# EAGLE design Variable and Constant (EAGLE 9.6.2)
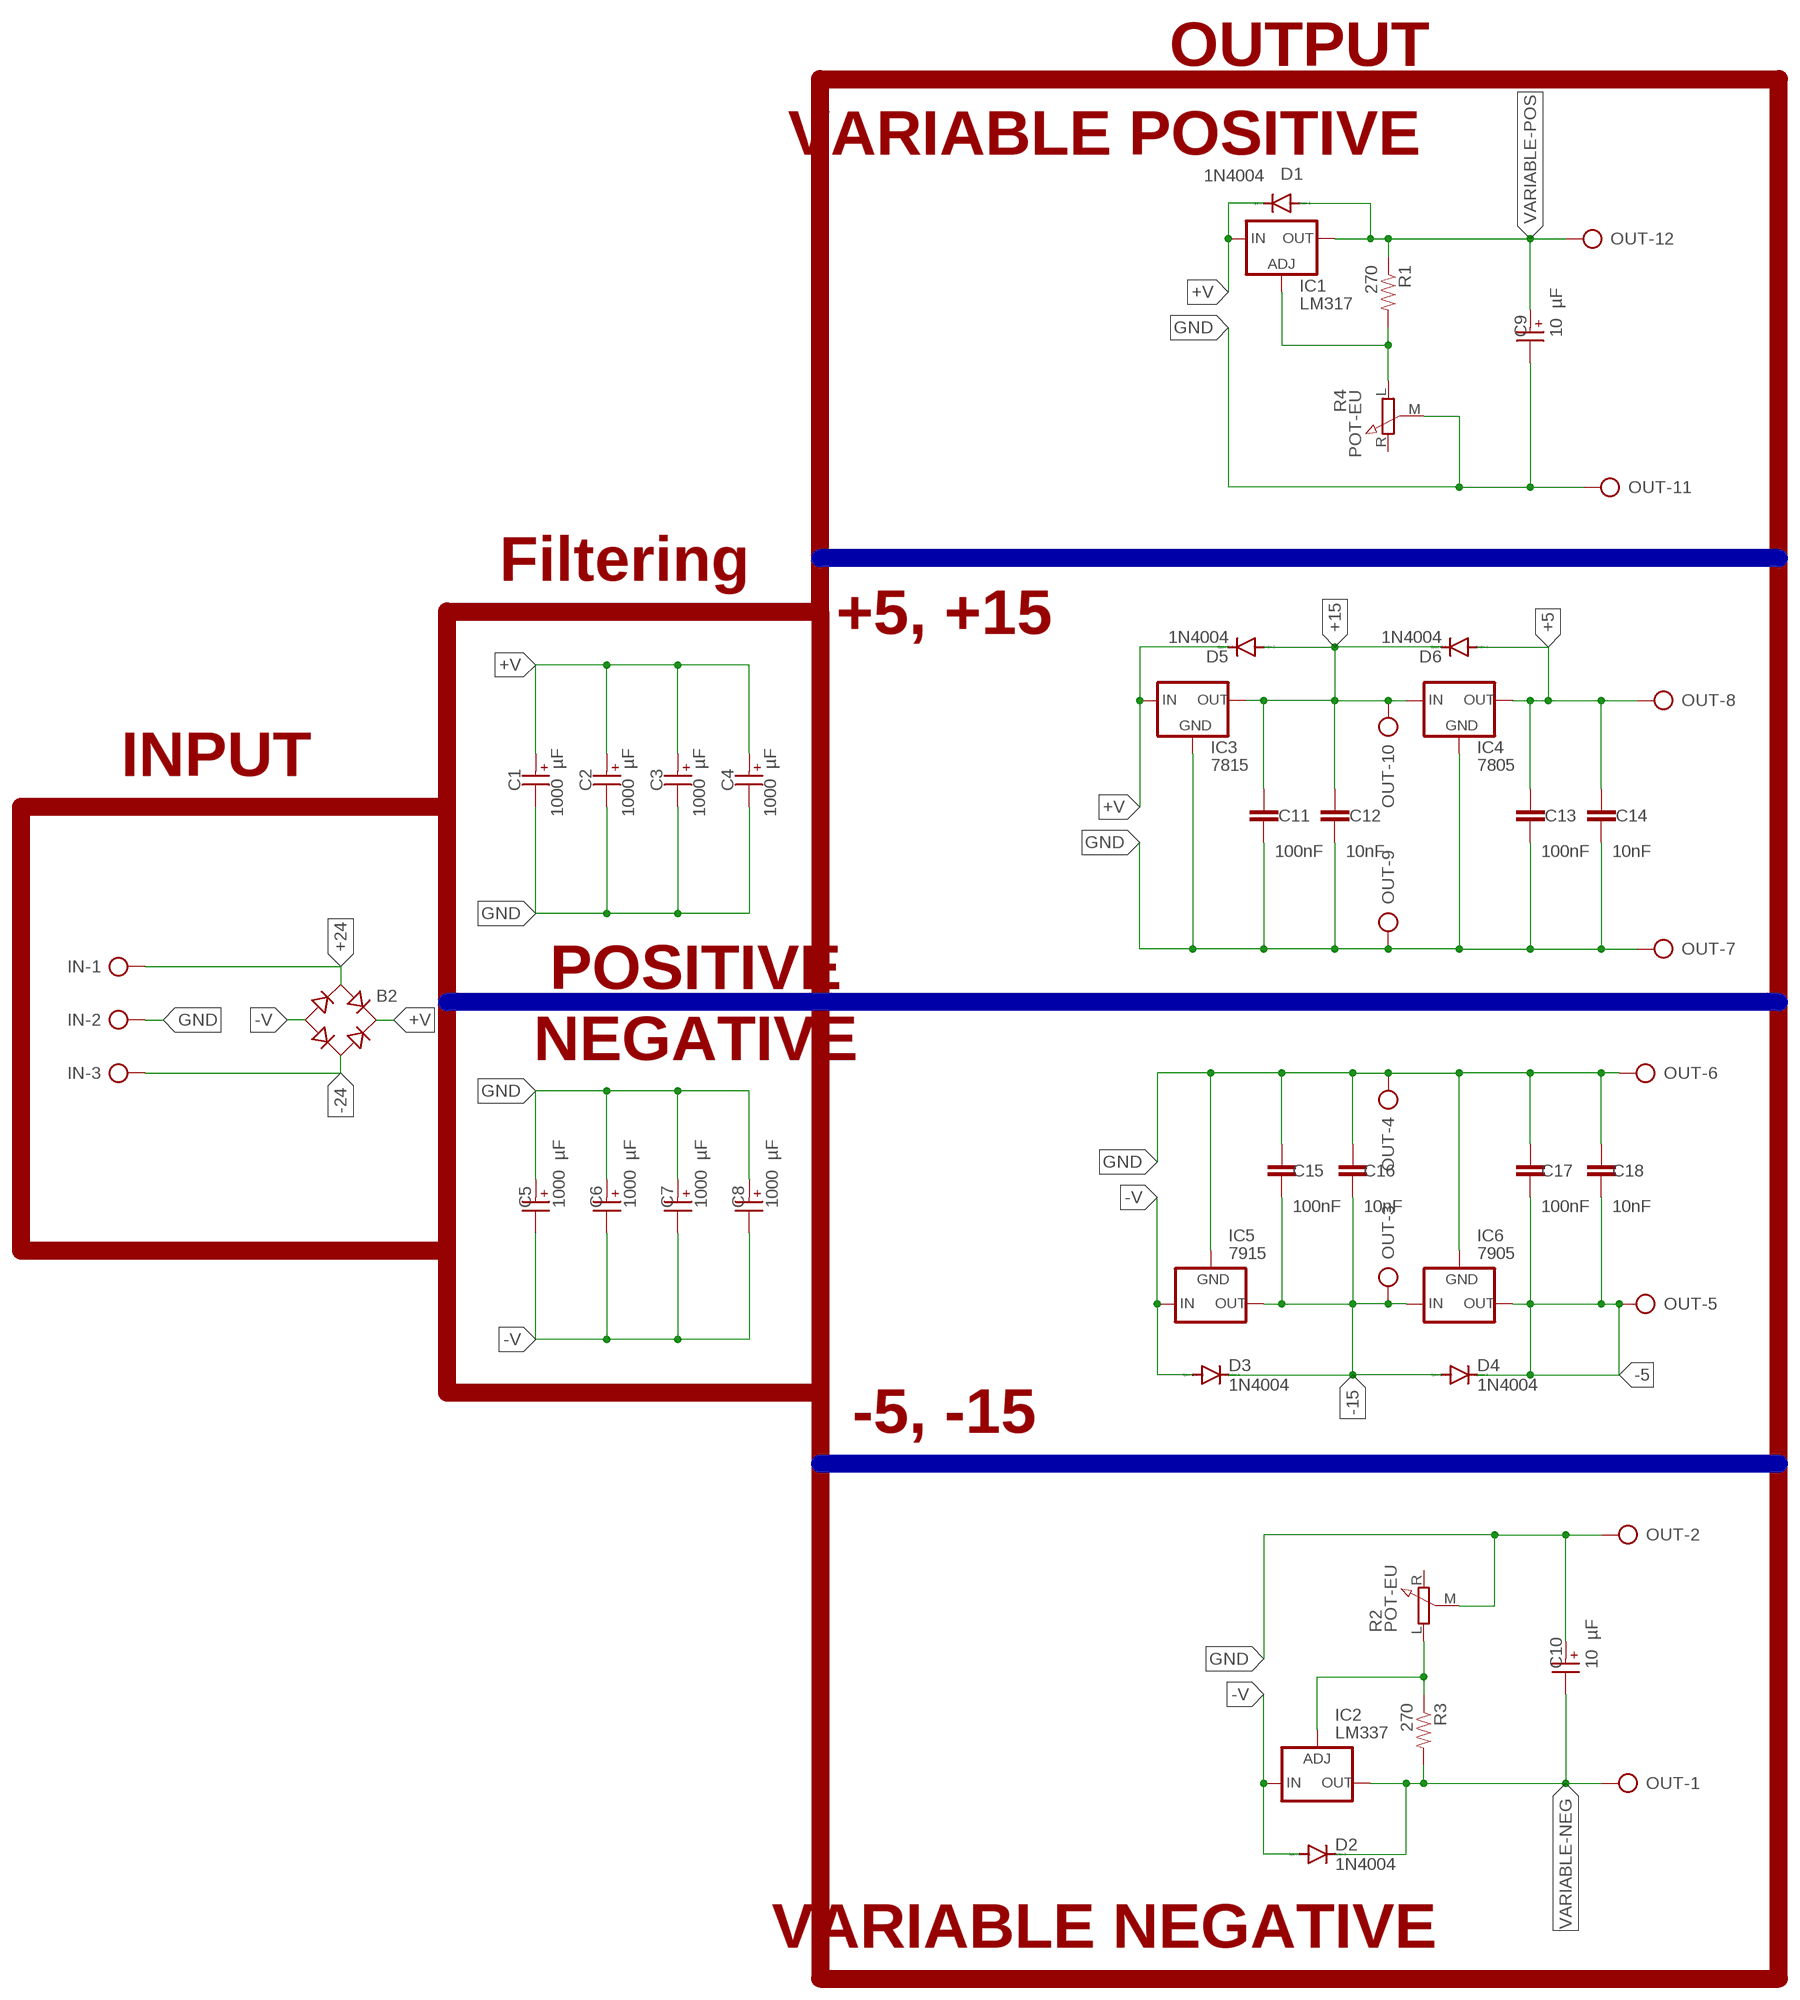
[diagram p0: schematic, sheet 1]

## Parts
B2  RB1A  [RB1A]
C1  1000 µF  WCAP-ATG8_10X12.5_860010275016  [WCAP-ATG8_10X12.5(DXL)]
C2  1000 µF  WCAP-ATG8_10X12.5_860010275016  [WCAP-ATG8_10X12.5(DXL)]
C3  1000 µF  WCAP-ATG8_10X12.5_860010275016  [WCAP-ATG8_10X12.5(DXL)]
C4  1000 µF  WCAP-ATG8_10X12.5_860010275016  [WCAP-ATG8_10X12.5(DXL)]
C5  1000 µF  WCAP-ATG8_10X12.5_860010275016  [WCAP-ATG8_10X12.5(DXL)]
C6  1000 µF  WCAP-ATG8_10X12.5_860010275016  [WCAP-ATG8_10X12.5(DXL)]
C7  1000 µF  WCAP-ATG8_10X12.5_860010275016  [WCAP-ATG8_10X12.5(DXL)]
C8  1000 µF  WCAP-ATG8_10X12.5_860010275016  [WCAP-ATG8_10X12.5(DXL)]
C9  10 µF  WCAP-ATG8_5X11_860010772009  [WCAP-ATG8_5X11(DXL)]
C10  10 µF  WCAP-ATG8_5X11_860010772009  [WCAP-ATG8_5X11(DXL)]
C11  100nF  0.1UF-KIT-EZ-50V-20%  [CAP-PTH-SMALL-KIT]
C12  10nF  0.1UF-KIT-EZ-50V-20%  [CAP-PTH-SMALL-KIT]
C13  100nF  0.1UF-KIT-EZ-50V-20%  [CAP-PTH-SMALL-KIT]
C14  10nF  0.1UF-KIT-EZ-50V-20%  [CAP-PTH-SMALL-KIT]
C15  100nF  0.1UF-KIT-EZ-50V-20%  [CAP-PTH-SMALL-KIT]
C16  10nF  0.1UF-KIT-EZ-50V-20%  [CAP-PTH-SMALL-KIT]
C17  100nF  0.1UF-KIT-EZ-50V-20%  [CAP-PTH-SMALL-KIT]
C18  10nF  0.1UF-KIT-EZ-50V-20%  [CAP-PTH-SMALL-KIT]
D1  1N4004  [DO41-10]
D2  1N4004  [DO41-10]
D3  1N4004  [DO41-10]
D4  1N4004  [DO41-10]
D5  1N4004  [DO41-10]
D6  1N4004  [DO41-10]
IC1  LM317  LM317TS  [317TS]
IC2  LM337  LM337TS  [337TS]
IC3  7815  78XXS  [78XXS]
IC4  7805  78XXS  [78XXS]
IC5  7915  79XXS  [79XXS]
IC6  7905  79XXS  [79XXS]
IN  AK500/3-H  [AK500/3-H]
OUT  AK500/12-H  [AK500/12-H]
R1  270  RESISTORAXIAL-0.3  [AXIAL-0.3]
R2  POT-EU  [RM-065]
R3  270  RESISTORAXIAL-0.3  [AXIAL-0.3]
R4  POT-EU  [RM-065]

## Nets
+5: C13.1 C14.1 D6.A IC4.OUT OUT.8
+15: C11.1 C12.1 D5.A D6.C IC3.OUT IC4.IN OUT.10
+24: B2.AC1 IN.1
+V: B2.+ C1.1(+) C2.1(+) C3.1(+) C4.1(+) D1.C D5.C IC1.3(IN) IC3.IN
-5: C17.2 C18.2 D4.C IC6.OUT OUT.5
-15: C15.2 C16.2 D3.C D4.A IC5.OUT IC6.IN OUT.3
-24: B2.AC2 IN.3
-V: B2.- C5.2(-) C6.2(-) C7.2(-) C8.2(-) D2.A D3.A IC2.2(IN) IC5.IN
GND: C1.2(-) C2.2(-) C3.2(-) C4.2(-) C5.1(+) C6.1(+) C7.1(+) C8.1(+) C9.2(-) C10.1(+) C11.2 C12.2 C13.2 C14.2 C15.1 C16.1 C17.1 C18.1 IC3.GND IC4.GND IC5.GND IC6.GND IN.2 OUT.2 OUT.4 OUT.6 OUT.7 OUT.9 OUT.11 R2.M R4.M
N$6: IC2.1(ADJ) R2.L R3.P$1
N$13: IC1.1(ADJ) R1.P$2 R4.L
VARIABLE-NEG: C10.2(-) D2.C IC2.3(OUT) OUT.1 R3.P$2
VARIABLE-POS: C9.1(+) D1.A IC1.2(OUT) OUT.12 R1.P$1
Unconnected: R2.R R4.R

## Buses
B$1
B$2
B$3

## Notes on the sheet
- OUTPUT
- VARIABLE POSITIVE
- Filtering
- +5, +15
- INPUT
- POSITIVE
- NEGATIVE
- -5, -15
- VARIABLE NEGATIVE

## Library data of the parts
B2 = rectifier:RB1A: RECTIFIER 1 A
C1-C8 = Aluminium Electrolyt Capacitors:WCAP-ATG8_10X12.5: WCAP-ATG8 Aluminium Electrolytic Capacitors General Purpose +85 °C Characteristics General purpose product series with max. operating temperature of +85 °C Wide range of capacitance value Mounting style: THT Radial Capacitance range: 0.1 µF ‒ 33000 µF Capacitance tolerance: ±20 % Voltage range (UR): 10 ‒ 400 V(DC) Operating temperature: -40 °C up to +85 °C for UR < 400 V(DC) -25 °C up to +85 °C for UR ≥ 400 V(DC) Endurance: 2000 h @ +85 °C Dimensions (DxL) in mm: 5.0 x 11.0 up to 22.0 x 51.0 Recommended soldering: Wave soldering Applications Filtering Smoothing Energy storage Coupling <https://www.we-online.com/catalog/media/o35732v209%20WCAP-ATG8_4C.jpg> Details see: https://www.we-online.com/catalog/en/WCAP-ATG8/ Updated by yingchun,Shan;2020-02-27 2020(C) Würth Elektronik; DATASHEET-URL: https://www.we-online.com/catalog/datasheet/860010275016.pdf; DF: 19%; DIAMETER: 10mm; I-LEAK: 100uA; I-RIPPLE: 726mA; L: 12.5mm; OPERATING-TEMPERATURE: -40 °C up to +85 °C; PART-NUMBER: 860010275016; PITCH: 5mm; TECHNICAL-REFERENCE: ATBF125102M010DSPA9B000; VR: 10V(DC)
C9 C10 = Aluminium Electrolyt Capacitors:WCAP-ATG8_5X11: WCAP-ATG8 Aluminium Electrolytic Capacitors General Purpose +85 °C Characteristics General purpose product series with max. operating temperature of +85 °C Wide range of capacitance value Mounting style: THT Radial Capacitance range: 0.1 µF ‒ 33000 µF Capacitance tolerance: ±20 % Voltage range (UR): 10 ‒ 400 V(DC) Operating temperature: -40 °C up to +85 °C for UR < 400 V(DC) -25 °C up to +85 °C for UR ≥ 400 V(DC) Endurance: 2000 h @ +85 °C Dimensions (DxL) in mm: 5.0 x 11.0 up to 22.0 x 51.0 Recommended soldering: Wave soldering Applications Filtering Smoothing Energy storage Coupling <https://www.we-online.com/catalog/media/o35732v209%20WCAP-ATG8_4C.jpg> Details see: https://www.we-online.com/catalog/en/WCAP-ATG8/ Updated by yingchun,Shan;2020-02-27 2020(C) Würth Elektronik; DATASHEET-URL: https://www.we-online.com/catalog/datasheet/860010772009.pdf; DF: 9%; DIAMETER: 5mm; I-LEAK: 6.3uA; I-RIPPLE: 77mA; L: 11mm; OPERATING-TEMPERATURE: -40 °C up to +85 °C; PART-NUMBER: 860010772009; PITCH: 2mm; TECHNICAL-REFERENCE: ATBC110100M063DSPA3B000; VR: 63V(DC)
C11-C18 = SparkFun-Capacitors:0.1UF: 0.1µF ceramic capacitors A capacitor is a passive two-terminal electrical component used to store electrical energy temporarily in an electric field.; PROD_ID: CAP-08370; VALUE: 0.1uF
D1-D6 = diode:1N4004: DIODE general purpose rectifier, 1 A
IC1 = v-reg:LM317TS: VOLTAGE REGULATOR
IC2 = v-reg:LM337TS: VOLTAGE REGULATOR
IC3 IC4 = v-reg:78XXS: VOLTAGE REGULATOR
IC5 IC6 = v-reg:79XXS: VOLTAGE REGULATOR
IN = con-ptr500:AK500/3-H: CONNECTOR Aug. 2004 / PTR Meßtechnik: Die Bezeichnung der Serie AK505 wurde geändert. Es handelt sich hierbei um AK500 in horizontaler Ausführung.; OC_FARNELL: unknown; OC_NEWARK: unknown
OUT = con-ptr500:AK500/12-H: CONNECTOR Aug. 2004 / PTR Meßtechnik: Die Bezeichnung der Serie AK505 wurde geändert. Es handelt sich hierbei um AK500 in horizontaler Ausführung.; OC_FARNELL: unknown; OC_NEWARK: unknown
R1 R3 = SparkFun-Resistors:RESISTOR: Generic Resistor Package
R2 R4 = Potentiometer:POT-EU

## Board
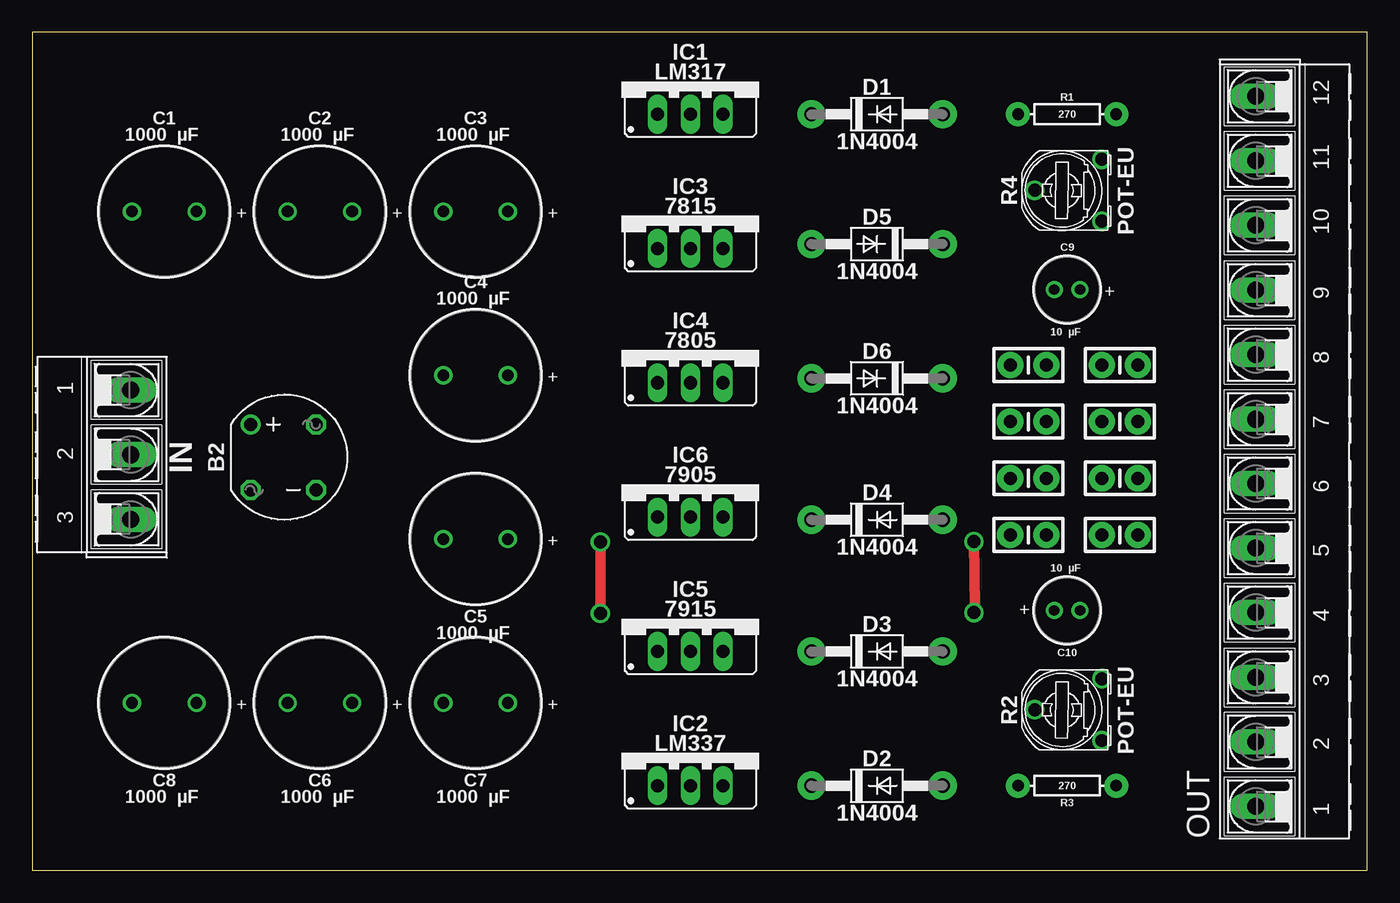
[diagram p1: board, top side]
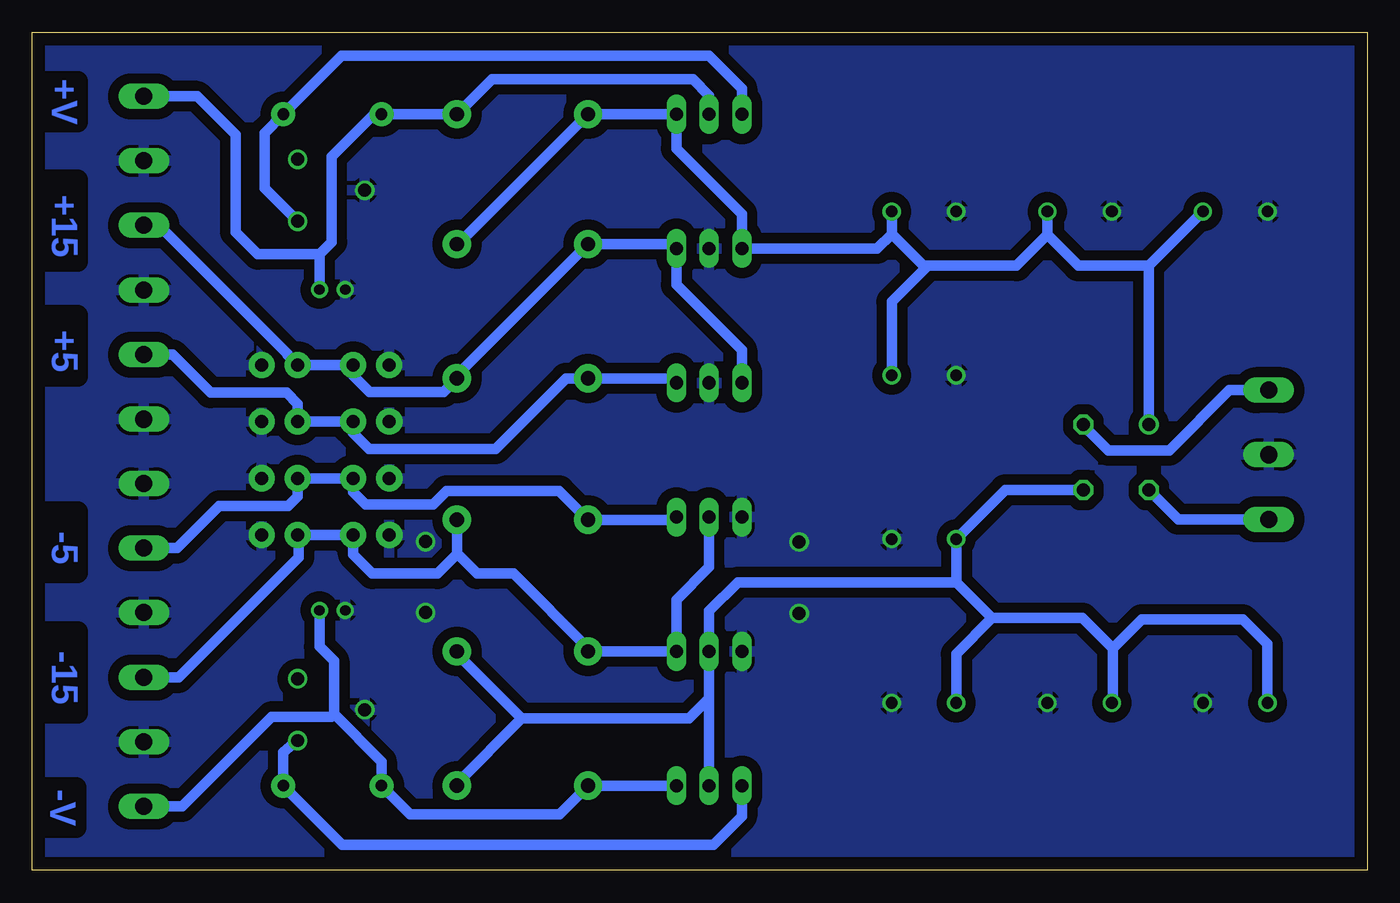
[diagram p2: board, bottom side, seen from below]

Size 103.5 x 65 mm. Coordinates in mm from the lower left corner, seen from the top.
Outline: 0,0 103.5,0 103.5,65 0,65 0,0
Copper layers (1*16): Top 0.035mm / dielectric 1.5mm / Bottom 0.035mm
Design rules "default *": minimum track width 0.8mm, minimum drill 0.7mm, track to track 0.6mm, track to pad 0.6mm, pad to pad 0.6mm, via to via 0.6mm, smd to smd 0.6mm, copper to edge 40mil, drill to drill 6mil, minimum pad ring 10mil, minimum via ring 8mil, stop-mask expansion 4mil, vias tented up to drill 0mil, thermal gap 10mil

### Footprints (pad centres in the part's own frame; a part is rotated, then mirrored left to right if it is on the bottom)
RB1A = drill 1.016: + -2.54,2.54 | drill 1.016 octagon: - 2.54,-2.54; AC1 2.54,2.54; AC2 -2.54,-2.54
WCAP-ATG8_10X12.5(DXL) = drill 0.9: 1 2.5,0; 2 -2.5,0
WCAP-ATG8_5X11(DXL) = drill 0.8: 1 1,0; 2 -1,0
CAP-PTH-SMALL-KIT = drill 1.016 pad 2.032: 1 -1.397,0; 2 1.397,0
DO41-10 = drill 1.118 pad 2.2: A 5.08,0; C -5.08,0
317TS = drill 1.016 long: 1 -2.54,-2.54; 2 0,-2.54; 3 2.54,-2.54
337TS = drill 1.016 long: 1 -2.54,-2.54; 2 0,-2.54; 3 2.54,-2.54
78XXS = drill 1.016 long: GND 0,-2.54; IN -2.54,-2.54; OUT 2.54,-2.54
79XXS = drill 1.016 long: GND -2.54,-2.54; IN 0,-2.54; OUT 2.54,-2.54
AK500/3-H = drill 1.321 long: 1 -5.004,0; 2 0,0; 3 5.004,0
AK500/12-H = drill 1.321 long: 1 -27.534,0; 2 -22.53,0; 3 -17.526,0; 4 -12.497,0; 5 -7.493,0; 6 -2.489,0; 7 2.489,0; 8 7.493,0; 9 12.497,0; 10 17.526,0; 11 22.53,0; 12 27.534,0
AXIAL-0.3 = drill 0.9 pad 1.88: P$1 -3.81,0; P$2 3.81,0
RM-065 = drill 1: L -2.373,-1.865; M 0.027,3.335; R 2.427,-1.865

### Placement (x,y rotation side)
B2  19.47,32.05 0 top
C1  10.24,51.1 0 top
C2  22.3,51.1 0 top
C3  34.37,51.1 0 top
C4  34.37,38.4 0 top
C5  34.37,25.7 0 top
C6  22.3,13 0 top
C7  34.37,13 0 top
C8  10.24,13 0 top
C9  80.23,45.04 0 top
C10  80.23,20.17 180 top
C11  77.23,39.2 180 top
C12  84.31,39.2 0 top
C13  77.22,34.8 180 top
C14  84.31,34.8 0 top
C15  77.22,26.02 0 top
C16  84.31,26.02 180 top
C17  77.22,30.41 0 top
C18  84.31,30.41 180 top
D1  65.49,58.64 0 top
D2  65.49,6.57 0 top
D3  65.49,16.99 0 top
D4  65.49,27.2 0 top
D5  65.49,48.57 180 top
D6  65.49,38.16 180 top
IC1  51.02,61.18 0 top
IC2  51.02,9.11 0 top
IC3  51.02,50.77 0 top
IC4  51.02,40.36 0 top
IC5  51.02,19.53 0 top
IC6  51.02,29.94 0 top
IN  7.64,32.24 270 top
OUT  94.85,32.5 90 top
R1  80.23,58.64 0 top
R2  81.06,12.44 90 top
R3  80.23,6.57 180 top
R4  81.06,52.72 90 top

### Tracks (layer width: path | path; a pad name or v marks a point on that pad's centre or on a via)
+5
  Bottom 0.8: IC4.OUT 53.9,38.16 D6.A 62.12,38.16 67.58,32.69 77.4,32.69 78.62,33.91 C13.1 C14.1 82.91,36.18 83.78,37.04 89.68,37.04 92.63,39.99 OUT.8
+15
  Bottom 0.8: IC4.IN 48.48,40.35 53.56,45.43 IC3.OUT 53.9,48.57 D5.A 70.57,38.41 D6.C 71.61,37.12 77.35,37.12 78.63,38.4 C11.1 C12.1 83.69,39.98 83.69,40.03 93.69,50.03 OUT.10
+24
  Bottom 0.8: IN.1 10.69,37.24 15.36,32.57 20.08,32.57 22.01,34.5 B2.AC1
+V
  Bottom 0.8: B2.+ 16.93,46.9 | 16.93,46.9 22.41,46.9 24.8,49.29 | 34.08,46.9 34.41,46.9 36.87,49.36 | 34.08,46.9 36.87,44.11 C4.1 | 24.8,49.29 27.19,46.9 34.08,46.9 | 36.87,49.36 37.99,48.23 IC3.IN 48.48,50.9 53.56,55.98 IC1.3 D1.C 70.48,48.57 D5.C | 16.93,46.9 C1.1 | 24.8,49.29 C2.1 | C3.1 36.87,49.36
-5
  Bottom 0.8: IC6.OUT 53.76,27.2 D4.C 62.65,29.44 71.38,29.44 72.43,28.39 77.65,28.39 78.62,29.36 C17.2 C18.2 82.91,29 83.65,28.27 89,28.27 92.27,25.01 OUT.5
-15
  Bottom 0.8: IC6.IN 51.02,23.52 53.56,20.98 IC5.OUT D3.C 60.41,17.24 66.19,23.03 69.03,23.03 70.57,24.57 | D4.A 70.57,24.57 | 70.57,24.57 70.57,24.53 72.08,23.03 77.13,23.03 78.62,24.51 C15.2 C16.2 82.84,25.95 82.84,24.28 92.15,14.97 OUT.3
-24
  Bottom 0.8: IN.3 14.66,27.23 B2.AC2
-V
  Bottom 0.8: B2.- 28.06,29.51 C5.2 31.87,22.34 | 29.09,19.57 31.87,22.34 | 19.73,17.22 22.08,19.57 29.09,19.57 | 19.73,17.22 19.73,13.07 C6.2 | 29.09,19.57 31.87,16.79 C7.2 | 19.73,17.22 17.48,19.47 9.65,19.47 7.74,17.55 C8.2 | 31.87,22.34 48.8,22.34 51.02,20.12 IC5.IN 51.02,13.36 | 51.02,13.36 IC2.2 | 51.02,13.36 52.6,11.79 65.56,11.79 | 65.56,11.79 70.57,16.8 D3.A | 65.56,11.79 70.57,6.77 D2.A
GND  (via drill 1)
  Top 0.8: v44.05,25.48 v44.05,19.94 v44.05,19.93 | v73,25.5 73.08,20.39 v73,20
  pour Bottom (isolate 0.8): -4.33,66.62 107.92,66.62 107.92,-5.1 -4.33,-5.1
N$6
  Bottom 0.8: IC2.1 48.48,4.21 50.7,1.99 79.46,1.99 R3.P$1 84.04,9.17 83,10.07 R2.L
N$13
  Bottom 0.8: IC1.1 48.48,60.62 51.03,63.17 79.52,63.17 R1.P$2 85.5,57.18 85.5,52.92 R4.L
VARIABLE-NEG
  Bottom 0.8: IC2.3 D2.C 62.64,4.34 74.19,4.34 R3.P$2 76.42,8.44 80.11,12.13 | C10.2 81.23,17.37 80.11,16.25 80.11,12.13 | OUT.1 91.88,4.97 84.93,11.92 80.32,11.92 80.11,12.13
VARIABLE-POS
  Bottom 0.8: R1.P$1 D1.A 67.87,61.34 52.28,61.34 51.02,60.09 IC1.2 | R1.P$1 | C9.1 81.23,47.79 | R1.P$1 77,58.64 80.28,55.37 80.28,48.74 81.23,47.79 | 81.23,47.79 86.02,47.79 87.73,49.51 87.73,57.05 90.72,60.03 OUT.12

### Text on the board
Bottom: +V | +15 | +5 | -5 | -15 | -V